# Altium schematic sheet powerRegulator.SchDoc
size A; SheetNumber: 1; SheetTotal: 1
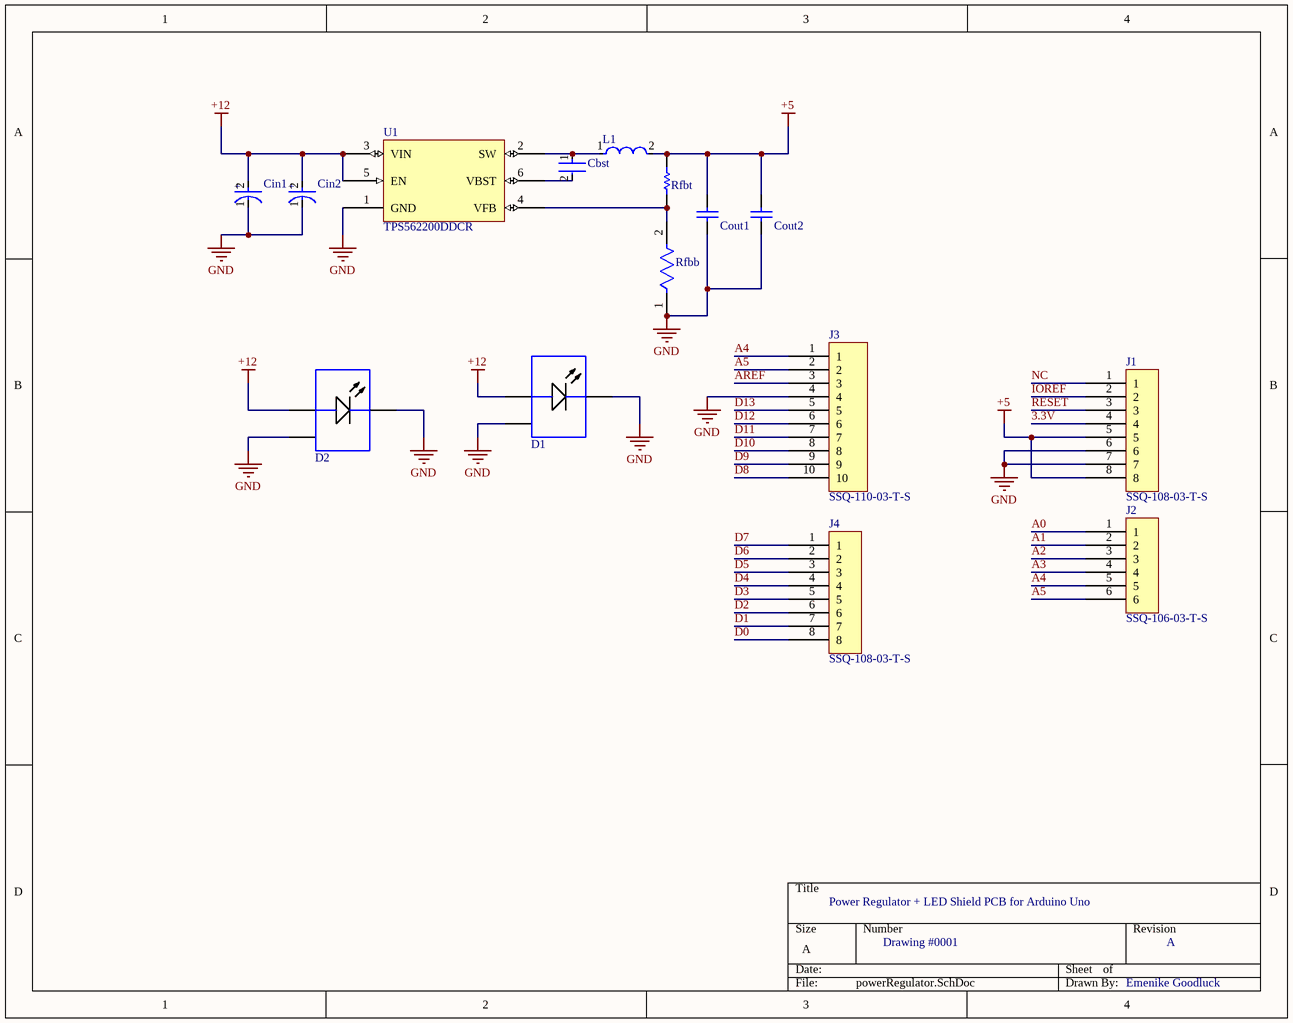
[diagram p0: powerRegulator.SchDoc]

## Parts
Cbst  CC0805KRX7R8BB104  [FP-CC0805-0_85-MFG]  (value not drawn)
Cin1  T491D106K035AT  [FP-T491D106K035AT-MFG]  (value not drawn)
Cin2  T491D106K035AT  [FP-T491D106K035AT-MFG]  (value not drawn)
Cout1  C1608X5R1A226M080AC  [CAPC1608X100X20ML10]  (value not drawn)
Cout2  C1608X5R1A226M080AC  [CAPC1608X100X20ML10]  (value not drawn)
D1  MKRAWT-00-0000-0D0HG235H  [CREE-MK-R-2_V]  (value not drawn)
D2  MKRAWT-00-0000-0D0HG235H  [CREE-MK-R-2_V]  (value not drawn)
J1  SSQ-108-03-T-S  [SSQ-108-03-T-S-Footprint-1]
J2  SSQ-106-03-T-S  [SSQ-108-03-T-S-Footprint-1]
J3  SSQ-110-03-T-S  [SSQ-108-03-T-S-Footprint-1]
J4  SSQ-108-03-T-S  [SSQ-108-03-T-S-Footprint-1]
L1  NR6028T4R7M  [FP-NR6028-MFG]  (value not drawn)
Rfbb  ERJ-1GNF1002C  [FP-ERJ1G-MFG]  (value not drawn)
Rfbt  CRCW020156K2FNED  [RESC0603X28X15NL05T05]  (value not drawn)
U1  TPS562200DDCR  [SOIC127P280X110-6N]

## Nets
+5: Cout1.2 Cout2.2 J1.5 J1.8 L1.2 Rfbt.2
+12: Cin1.2(A) Cin2.2(A) D1.1(A) D2.1(A) U1.3(VIN) U1.5(EN)
GND: Cin1.1(C) Cin2.1(C) Cout1.1 Cout2.1 D1.2(K) D1.3(EP) D2.2(K) D2.3(EP) J1.6 J1.7 J3.4 Rfbb.1 U1.1(GND)
3.3V: J1.4
A0: J2.1
A1: J2.2
A2: J2.3
A3: J2.4
A4: J2.5 J3.1
A5: J2.6 J3.2
AREF: J3.3
D0: J4.8
D1: J4.7
D2: J4.6
D3: J4.5
D4: J4.4
D5: J4.3
D6: J4.2
D7: J4.1
D8: J3.10
D9: J3.9
D10: J3.8
D11: J3.7
D12: J3.6
D13: J3.5
IOREF: J1.2
NC: J1.1
RESET: J1.3
NetCbst_1: Cbst.1 L1.1 U1.2(SW)
NetCbst_2: Cbst.2 U1.6(VBST)
NetRfbb_2: Rfbb.2 Rfbt.1 U1.4(VFB)

## Notes on the sheet
- Power Regulator + LED Shield PCB for Arduino Uno
- Drawing #0001
- A
- Emenike Goodluck
- (in symbol CMP-2000-07580-2) +

## Library data of the parts
Cbst = CMP-1036-04410-2: CAP CER 0.1UF 25V X7R 0805; Manufacturer: Yageo; Tolerance: 0.1; Value: 100 nF; Description: CC0805 100 nF X7R 10.00% 25 V; ComponentLink2URL: http://www.yageo.com/documents/recent/UPY-GPHC_Y5V_6.3V-to-50V_8.pdf; Category: Cap; Mouser Description: Multilayer Ceramic Capacitors MLCC - SMD/SMT 100nF 25V X7R 10%; Manufacturer Part Number: CC0805KRX7R8BB104; Device Class L1: Passive Components; Footprint Url: http://www.yageo.com/exep/pages/download/literatures/UPY-C_GEN_24.pdf; Height: 0.95mm; Material: Ceramic; Digikey Description: CAP CER 0.1UF 25V X7R 0805; Lead Free: Yes; Temperature Range High: +85°C; Temperature: -30°C to +85°C; Ipc Land Pattern Name: CAPC200125X85; Capacitance: 100 nF; Automotive: No; Octopart: https://octopart.com/cc0805krx7r8bb104-yageo-39467766; Device Class L2: Capacitors; Temperature Characteristic: X7R; Voltage Rating: 25 V; ComponentLink2Description: Datasheet; Temperature Range Low: -30°C; Device Class L3: Ceramic Capacitors; RoHS: TRUE; Package: CC0805-0.85
Cin1 Cin2 = CMP-2000-07580-2: CAP TANT 10UF 10% 35V 2917; Dissipation Factor: 6%; Life (Hours): 2000Hour; Leakage Current: 3.5uA; Polarity: Polar; ESR (Equivalent Series Resistance): 1R; Tolerance: 20%; Dielectric Material: Tantalum; Lead Free: Lead Free; Termination: SMD/SMT; Length: 7.3mm; Voltage: 35V; Height: 2.8mm; Depth: 4.3mm; Case/Package: 2917; Height - Seated (Max): 0.122inch; Max Operating Temperature: 125°C; Package Quantity: 1; Mount: Surface Mount; REACH SVHC: No SVHC; Min Operating Temperature: -55°C; Voltage Rating (DC): 35V; Radiation Hardening: No; Features: General Purpose; Width: 4.3mm; RoHS Compliant: Yes; Capacitance: 10uF; Packaging: Tape and Reel; Case Code (Metric): 7343; Voltage Rating: 35V; Case Code (Imperial): 2917; Number of Pins: 2
Cout1 Cout2 = CMP-2000-05441-1: Chip Capacitor, 22 uF, +/- 20%, 10 V, -55 to 85 degC, 0603 (1608 Metric), RoHS, Tape and Reel; Manufacturer: TDK; PCN Part Number: MLCCPartNumberChange30/Nov/2012; Voltage - Rated: 10V; Product Training Modules: CSeriesGeneralApplicationsSEAT,CCV,andTVCLDesignToolsGuidetoReplacinganElectrolyticCapacitorwithanMLCC; Other Names: 445-9077-1; Design Resources: 20WNon-IsolatedBuckLEDDriverUsingPLLNK460KG; Online Catalog: CSeries,GeneralPurpose; Capacitance: 22µF; Temperature Coefficient: X5R; Kits: 445-9014-KIT-ND-KITMLCC100PF-22UF060310-50V; Packaging: CutTape(CT); Standard Package: 1; Package / Case: 0603(1608Metric); Lead Style: -; Features: -; Ratings: -; Operating Temperature: -55degC~85degC; Applications: GeneralPurpose; Package Reference: 603; Datasheet URL: http://download.siliconexpert.com/pdfs/2015/4/21/15/54/45/779/tdk_/manual/37024850441143360mlcc_commercial_general_en.pdf; Datasheet Version: Mar-15; Mounting Type: SurfaceMount,MLCC; Lead Spacing: -; Size / Dimension: 0.063"Lx0.031"W(1.60mmx0.80mm); Height - Seated (Max): -; Package Description: 2-Pin Surface Mount Device, Body 1.6 x 0.8 mm; Manufacturer URL: http://www.tdk.com/; RoHS Information: RoHSCertificate-MLCC; Tolerance: ±20%; Series: C; Thickness (Max): 0.035"(0.90mm); Family: CeramicCapacitors; Category: Capacitors
D1 D2 = CMP-2100-00977-1: LED, White, 12 V, 2-Pin SMD, RoHS, Tape and Reel
J1 J4 = CMP-00003-2: Headers & Wire Housings Tiger Buy Socket Strip with Square Tails, 0.100 Pitch; Number of Positions: 8; Connector Type: Receptacle; Gender: Female; Pitch: 0.1inch; Housing Material: Plastic; Number of Rows: 1; RoHS Compliant: Yes; Height: 8.51mm; Radiation Hardening: No; Termination: Solder; Series: SSQ; Lead Free: Lead Free; Number of Contacts: 8; Housing Color: Black; Contact Type: Female Socket; Mount: Through Hole; Color: Black; Width: 2.41mm; Length: 20.8mm; Packaging: Bulk; Contact Material: Bronze; Contact Plating: Tin
J2 = CMP-00006-2: Headers & Wire Housings Tiger Buy Socket Strip with Square Tails, 0.100 Pitch; Pitch: 0.1inch; Gender: Female; Number of Contacts: 6; Connector Type: Receptacle; Contact Plating: Tin; Color: Black; Lead Free: Lead Free; Number of Rows: 1; Height: 8.51mm; Termination: Solder; Contact Type: Female Socket; Width: 2.41mm; Series: SSQ; Length: 15.8mm; Packaging: Bulk; Radiation Hardening: No; Housing Material: Plastic; Number of Positions: 6; Mount: Through Hole; Contact Material: Bronze; Housing Color: Black; RoHS Compliant: Yes
J3 = CMP-00007-1: Headers & Wire Housings Tiger Buy Socket Strip with Square Tails, 0.100 Pitch; Number of Contacts: 10; Gender: Female; Pitch: 0.1inch; Connector Type: Receptacle; Housing Color: Black; Length: 25.9mm; Radiation Hardening: No; Height: 8.51mm; Color: Black; RoHS Compliant: Yes; Series: SSQ; Package Quantity: 1; Width: 2.41mm; Number of Rows: 1; Contact Material: Bronze; Mount: Through Hole; Packaging: Bulk; Termination: Solder; Lead Free: Lead Free; Contact Plating: Tin; Number of Positions: 10; Contact Type: Female Socket; Housing Material: Plastic
L1 = CMP-14484-000037-2: SMD Power Inductors 4.7uH ±20% 2.7A 40.3mΩ; Max DC Current: 3A; Shielding: Shielded; Core Material: Ferrite; Test Frequency: 100kHz; Self Resonant Frequency: 39MHz; DC Resistance (DCR): 40.3mR; Package Quantity: 2000; Mount: Surface Mount; Max Operating Temperature: 120°C; Min Operating Temperature: -25°C; Series: NR; Case/Package: 2424; Depth: 6.2mm; Inductance Tolerance: 20%; Halogen Free: Halogen Free; Inductance: 4.7uH; Tolerance: 20%; RoHS Compliant: Yes; Width: 0.236inch; Length: 0.236inch; Lead Free: Lead Free; Radiation Hardening: No; Packaging: Tape and Reel; Number of Pins: 2; Saturation Current: 2.7A; Current Rating: 3A; Height - Seated (Max): 0.11inch; RMS Current (Irms): 3A; Termination: SMD/SMT; Height: 2.8mm; Resistor Type: Wirewound
Rfbb = CMP-2004-03445-2: RES SMD 10K OHM 1% 1/20W 0201; Manufacturer: Panasonic Electronic Components; Power Rating: 0.05W; Voltage Rating: 25V; Resistance: 10kΩ; Automotive Grade: Grade 1; Value: 10kΩ; Temperature Coefficient: 200ppm/°C; Description: 10 kOhms ±1% 0.05W, 1/20W Chip Resistor 0201 (0603 Metric) Automotive AEC-Q200 Thick Film; Temperature: -55°C to +125°C; Manufacturer Part Number: ERJ-1GNF1002C; Footprint Url: https://industrial.panasonic.com/cdbs/www-data/pdf/RDA0000/DMA0000COL17.pdf; Digikey Description: RES SMD 10K OHM 1% 1/20W 0201; ComponentLink2URL: https://industrial.panasonic.com/cdbs/www-data/pdf/RDA0000/AOA0000C304.pdf; Octopart: https://octopart.com/erj-1gnf1002c-panasonic-55419697; Height: 0.26mm; Temperature Range High: +125°C; Composition: Thick Film; ComponentLink2Description: Datasheet; Device Class L2: Resistors; Temperature Range Low: -55°C; Device Class L3: Chip SMD Resistors; Package: ERJ1G; Lead Free: Yes; Automotive: Yes; Category: Res; Device Class L1: Passive Components; Tolerance: 1%; Mouser Description: Thick Film Resistors - SMD 0201 10Kohm 1% HalogenFree AEC-Q200; Series: ERJ; RoHS: TRUE
Rfbt = CMP-2004-00723-1: Manufacturer: Vishay Dale; Part Number: CRCW020156K2FNED
U1 = CMP-00005-3: Buck Switching Regulator IC Positive Adjustable 0.765V 1 Output 2A SOT-23-6 Thin, TSOT-23-6; Max Output Voltage: 7V; Synchronous Rectifier: Yes; Number of Outputs: 1; Switching Frequency: 650kHz; Quiescent Current: 230uA; Min Input Voltage: 4.5V; Min Output Voltage: 765mV; Max Input Voltage: 17V; Output Configuration: Positive; Mount: Surface Mount; Max Output Current: 2A; Case/Package: SOT-23-6; Output Voltage: 7V; Package Quantity: 3000; Radiation Hardening: No; Packaging: Tape and Reel; Lead Free: Lead Free; Weight: 0.00127oz; Number of Pins: 6; Min Operating Temperature: -40°C; Output Current: 2A; Contact Plating: Tin; Reach SVHC Compliant: Yes; Output Type: Adjustable; Series: D-CAP2™, Eco-Mode™; Max Operating Temperature: 125°C; Operating Supply Voltage: 17V; RoHS Compliant: Yes